# EasyEDA schematic LcsNodes-Ext-Dual-Power-Module-B.02.00.json

## Sheets
1 Extension Connector, Bridge, RailCom Dectector: TITLE: LcsNodes-Ext-Dual-Power-Module\nConnector, Logic; REV: B.02.00; Date: 2023-01-27; Sheet: 2/2; Drawn By: helmut-f; Company: Your Company
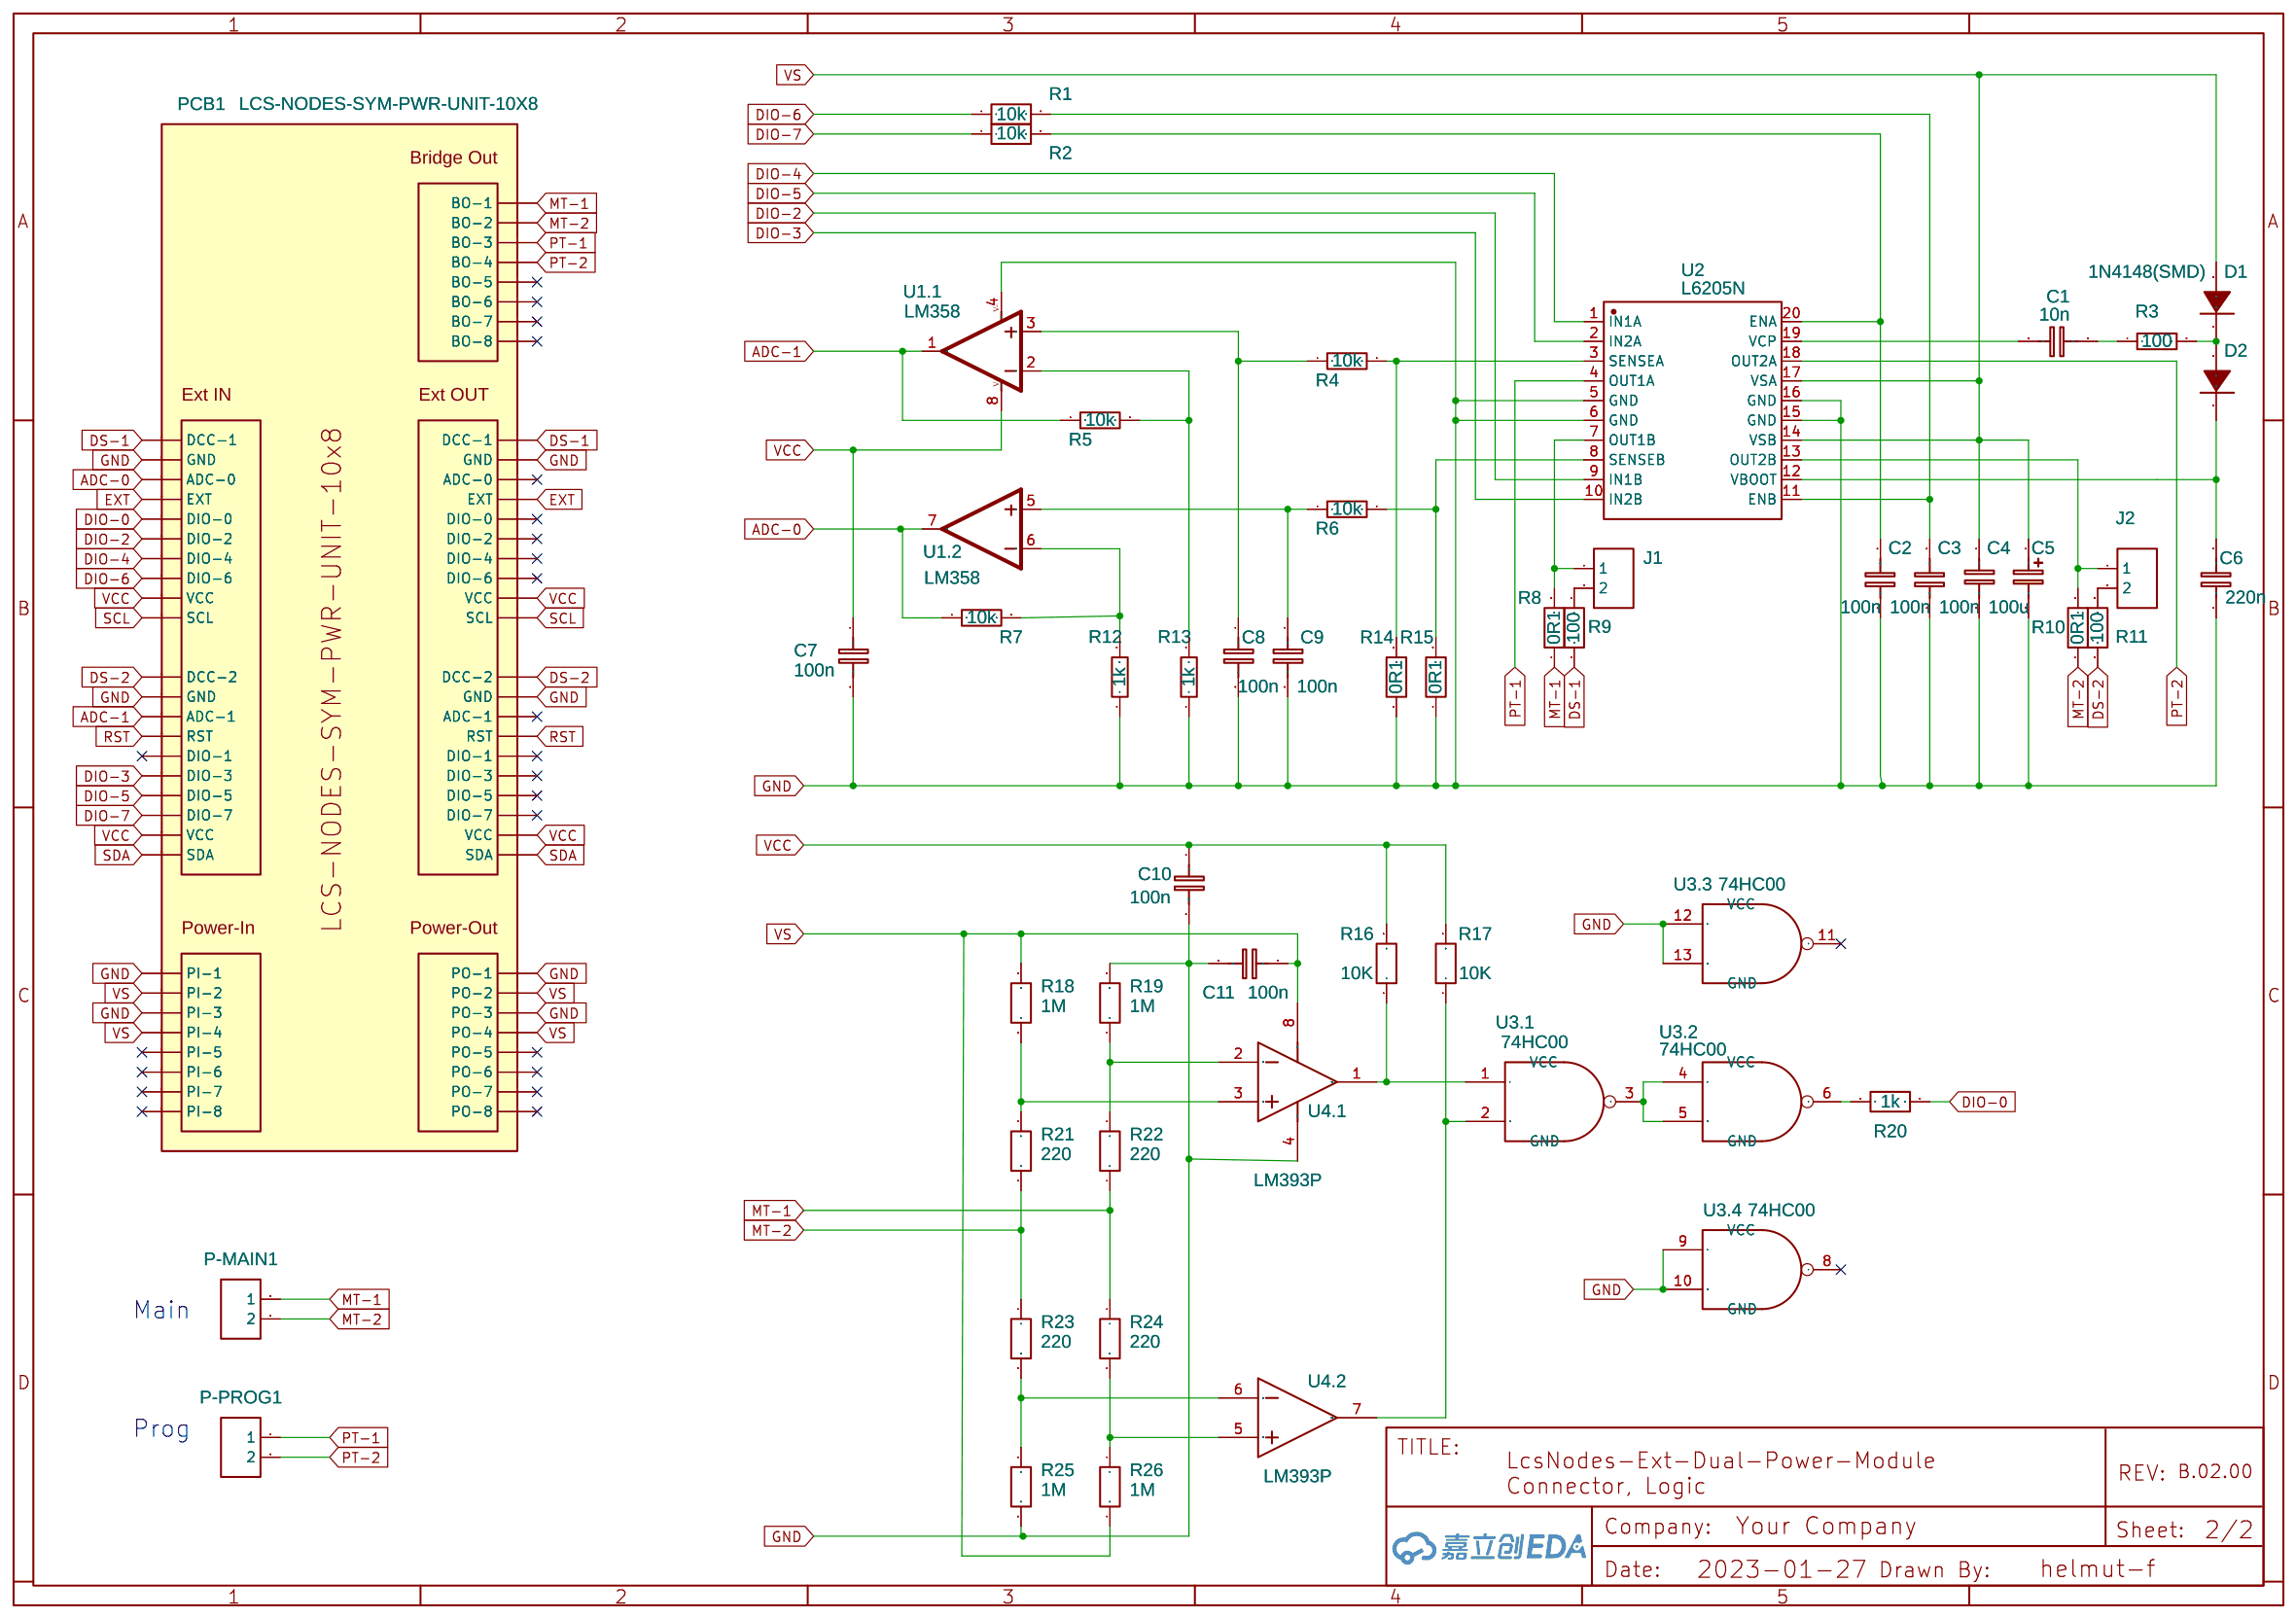
[diagram p0: Extension Connector, Bridge, RailCom Dectector]
2 Block Diagram: TITLE: LcsNodes-Ext-Dual-Power-Module\nBlock Diagram; REV: 1.0; Date: 2023-03-13; Sheet: 1/2
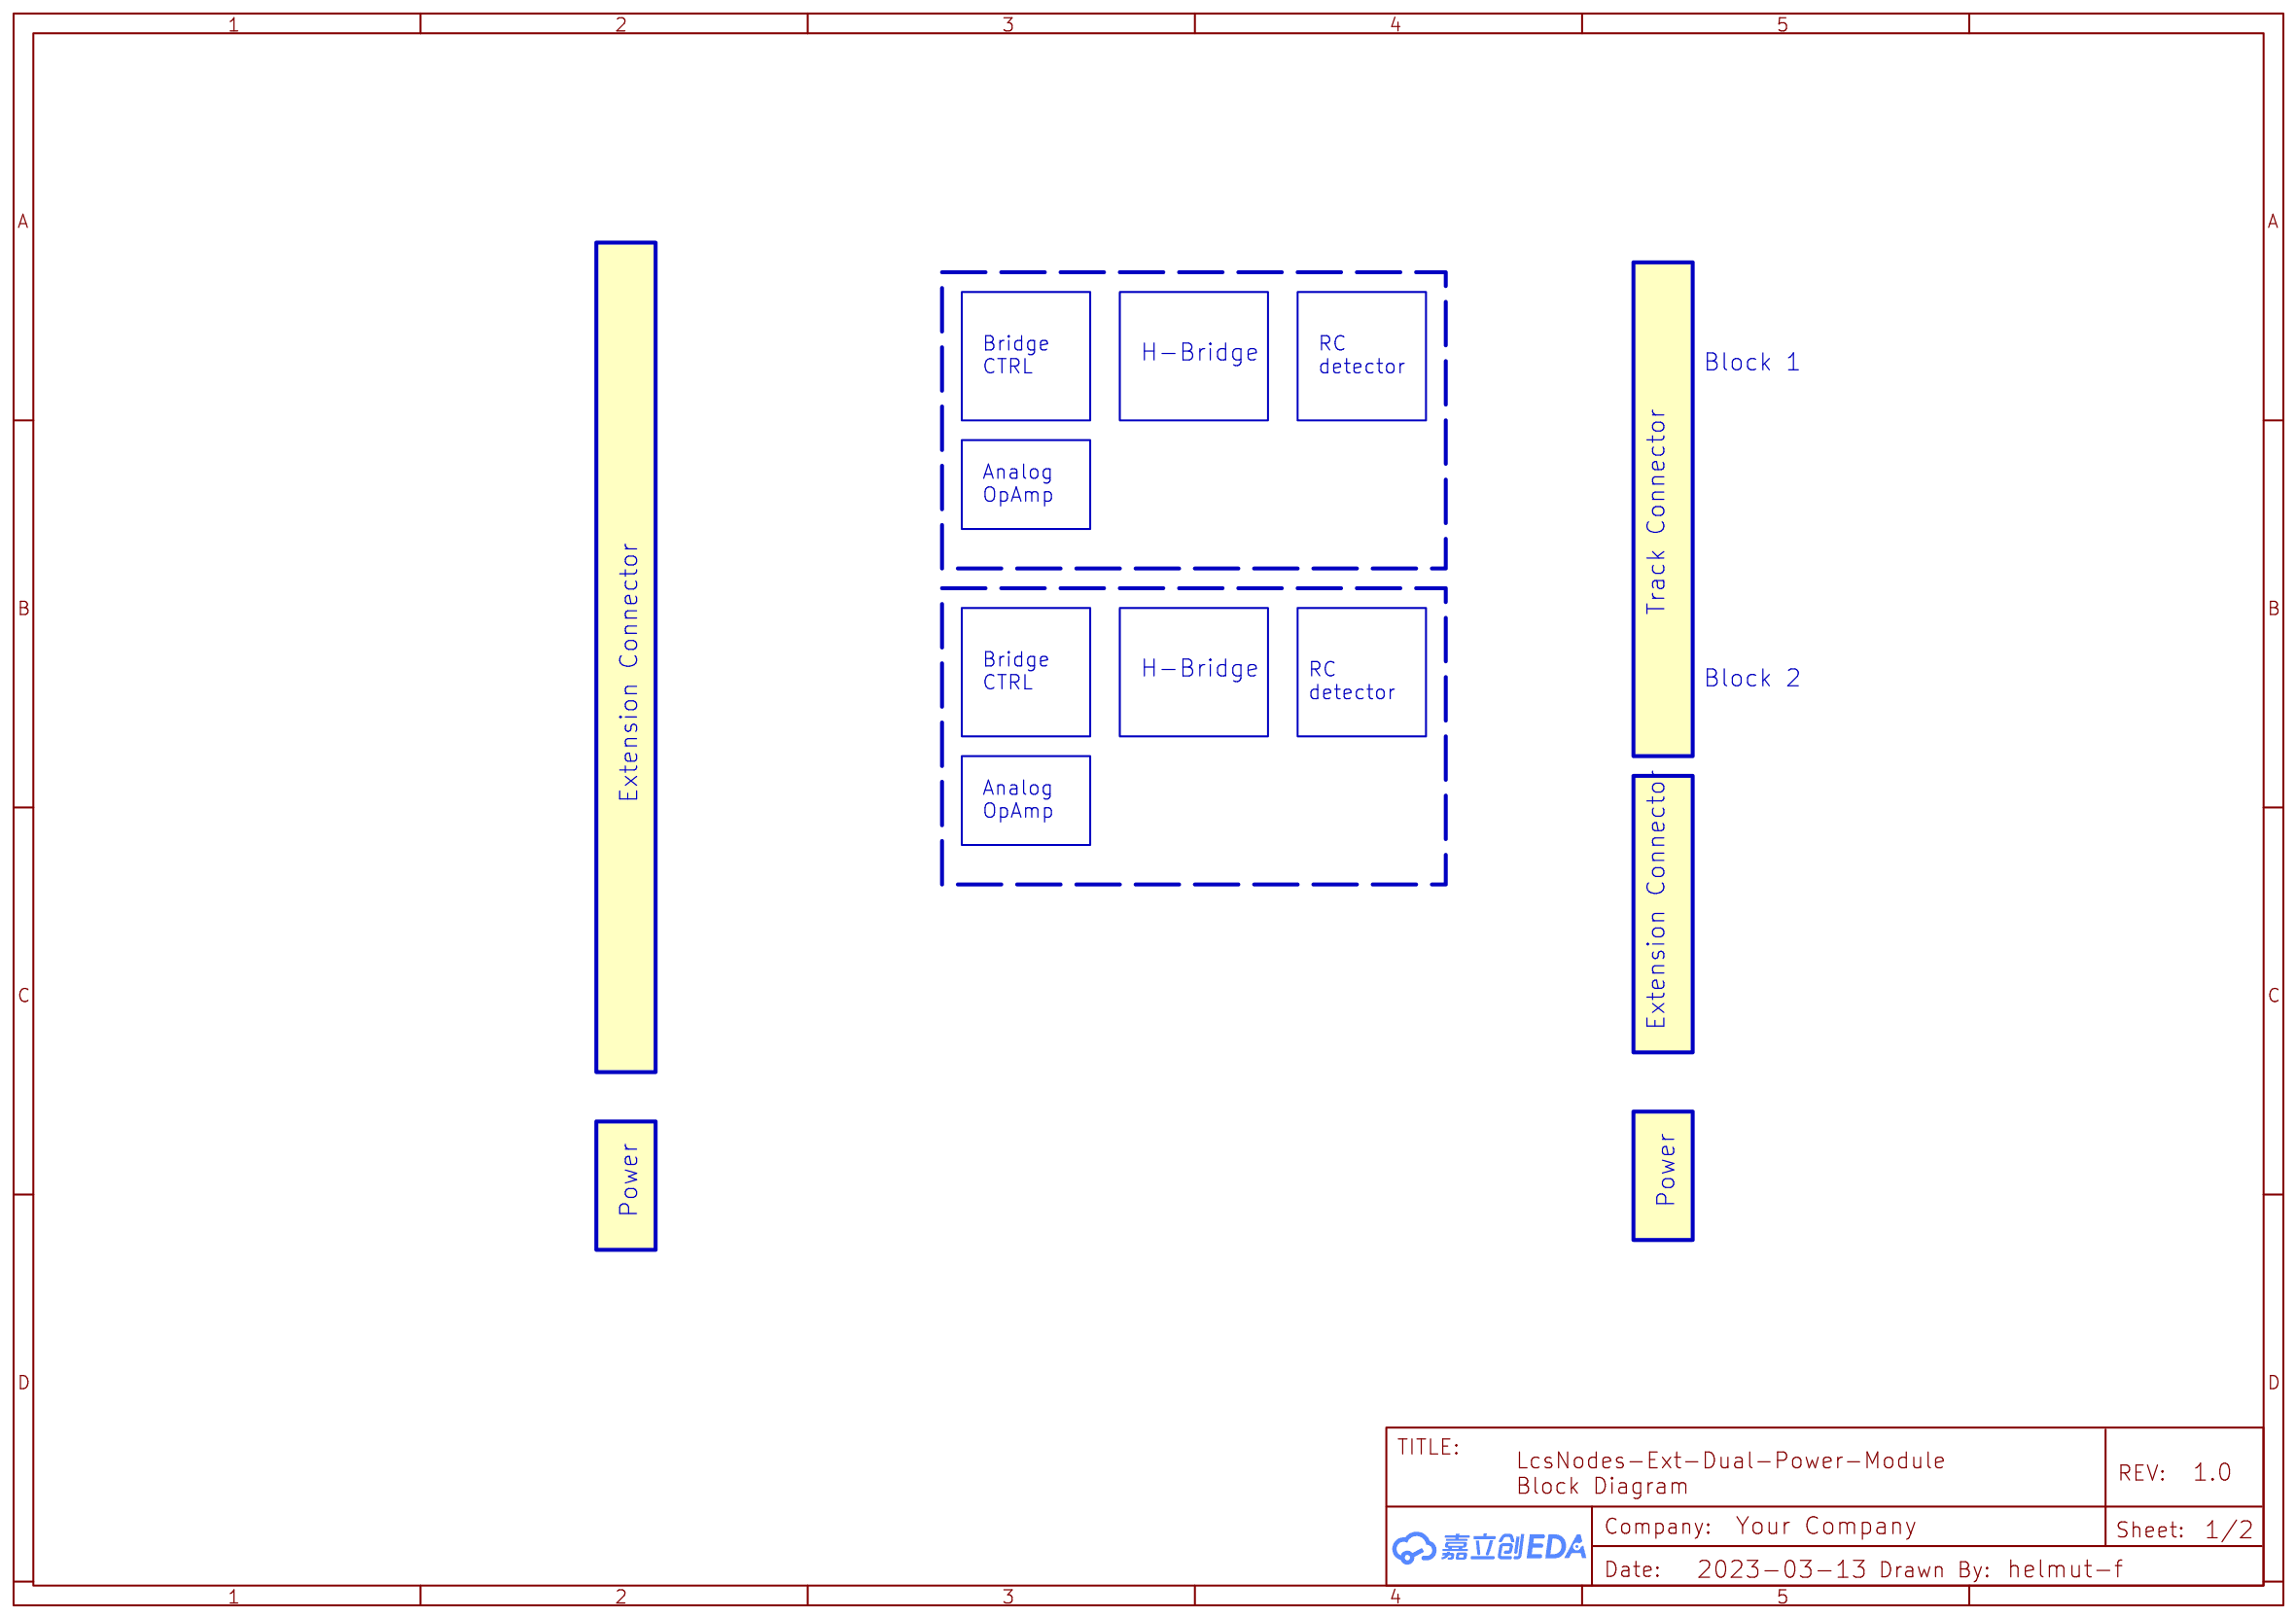
[diagram p1: Block Diagram]

## Parts
C1  10n  [C1206]
C2  100n  [C1206]
C3  100n  [C1206]
C4  100n  [C1206]
C5  100u  [CAP-D6.3×H7.7]
C6  220n  [C1206]
C7  100n  [C1206]
C8  100n  [C1206]
C9  100n  [C1206]
C10  100n  [C1206]
C11  100n  [C1206]
D1  1N4148(SMD)  [LL-34_L3.5-W1.5-RD]
D2  1N4148(SMD)  [LL-34_L3.5-W1.5-RD]
J1  HDR-M-2.54_1x2  [HDR-M-2.54_1X2]
J2  HDR-M-2.54_1x2  [HDR-M-2.54_1X2]
P-MAIN1  CONN-TH_2P-P5.08  [CONN-TH_2P-P5.08]
P-PROG1  CONN-TH_2P-P5.08  [CONN-TH_2P-P5.08]
PCB1  LCS-NODES-SYM-PWR-UNIT-10X8  [LCS-NODES-FP-PWR-UNIT-10X8]
R1  10k  [R1206]
R2  10k  [R1206]
R3  100  [R1206]
R4  10k  [R1206]
R5  10k  [R1206]
R6  10k  [R1206]
R7  10k  [R1206]
R8  0R1  [R_AXIAL-0.6]
R9  100  [R1206]
R10  0R1  [R_AXIAL-0.6]
R11  100  [R1206]
R12  1k  [R1206]
R13  1k  [R1206]
R14  0R1  [R_AXIAL-0.6]
R15  0R1  [R_AXIAL-0.6]
R16  10K  [R1206]
R17  10K  [R1206]
R18  1M  [R1206]
R19  1M  [R1206]
R20  1k  [R1206]
R21  220  [R1206]
R22  220  [R1206]
R23  220  [R1206]
R24  220  [R1206]
R25  1M  [R1206]
R26  1M  [R1206]
U1  LM358  [DIP-8_L10.1-W6.3-P2.54-LS7.6-BL]  (sections 1,2)
U2  L6205N  [PDIP-20_L24.5-W7.3-P2.54-LS7.9-BL]
U3  74HC00  [PDIP-14_L19.2-W6.4-P2.54-LS8.0-BL]  (sections 1,2,3,4)
U4  LM393P  [DIP-8_L10.1-W6.3-P2.54-LS7.6-BL]  (sections 1,2)

## Library data of the parts
C1-C4 C6 = C_0603_EU: Contributor: LCEDA_Lib
C5 = C_Tan_SMD_A_EU: Contributor: LCEDA_Lib
C7-C11 = C_0603_EU: Contributor: LCEDA_Lib; Package Display: No
D1 D2 = 1N4148(SMD): Contributor: lcsc; Supplier: LCSC; Supplier Part: C9900022326; Manufacturer: null; JLCPCB Part Class: Extended Part; link: https://lcsc.com/eda_search?q=C9900022326&%26type=1&ref=editor
J1 J2 = HDR-M-2.54_1x2: Supplier Part: C124375; Supplier: LCSC; Contributor: LCEDA_Lib
P-MAIN1 P-PROG1 = CONN-TH_2P-P5.08: Supplier: LCSC; Contributor: LCEDA_Lib
PCB1 = LCS-NODES-SYM-PWR-UNIT-10X8: Contributor: helmut-f; Package Display: No
R1 R2 R8-R11 R16 R17 R19-R26 = R_AXIAL-0.3_EU: Contributor: LCEDA_Lib
R3-R7 R12 R13 = RESISTOR-AXIAL-0.1
R14 R15 = R_AXIAL-0.5_EU: Contributor: LCEDA_Lib
R18 = R_AXIAL-0.3_EU: Contributor: LCEDA_Lib; Package Display: No
U1 = LM358: Contributor: SparkFun; subpart_no: 1
U2 = L6205N: Supplier: LCSC; Supplier Part: C962260; Manufacturer: STMicroelectronics; Contributor: LCSC
U3 = 74HC00: Contributor: David EL; subpart_no: 1
U4 = LM393P: Supplier: LCSC; Manufacturer: TI; image: //image.lceda.cn/szlcsc/C5209.jpg; Supplier Part: C5209; subpart_no: 1

## Nets
GND: C2.1 C3.1 C4.2 C5.2 C6.1 C7.2 C8.2 C9.2 C10.2 C11.2 PCB1.11(GND) PCB1.21(GND) PCB1.34(PI-1) PCB1.35(PI-3) PCB1.51(GND) PCB1.61(GND) PCB1.70(PO-1) PCB1.71(PO-3) R12.1 R13.1 R14.1 R15.1 R19.2 R25.2 U1.4(V-) U2.5(GND) U2.6(GND) U2.15(GND) U2.16(GND) U3.9(A) U3.10(B) U3.12(A) U3.13(B) U4.4(GND)
VCC: C7.1 C10.1 PCB1.18(VCC) PCB1.28(VCC) PCB1.58(VCC) PCB1.68(VCC) R16.2 R17.2 U1.8(V+)
ADC-0: PCB1.22(ADC-0) R7.1 U1.7(OUT)
ADC-1: PCB1.12(ADC-1) R5.1 U1.1(OUT)
DIO-0: PCB1.24(DIO-0) R20.1
DIO-2: PCB1.25(DIO-2) U2.9(IN1B)
DIO-3: PCB1.15(DIO-3) U2.10(IN2B)
DIO-4: PCB1.26(DIO-4) U2.1(IN1A)
DIO-5: PCB1.16(DIO-5) U2.2(IN2A)
DIO-6: PCB1.27(DIO-6) R1.1
DIO-7: PCB1.17(DIO-7) R2.1
DS-1: PCB1.20(DCC-1) PCB1.50(DCC-1) R9.2
DS-2: PCB1.10(DCC-2) PCB1.60(DCC-2) R11.1
EXT: PCB1.23(EXT) PCB1.53(EXT)
MT-1: P-MAIN1.1 PCB1.40(BO-1) R8.1 R22.1 R24.1
MT-2: P-MAIN1.2 PCB1.44(BO-2) R10.1 R21.1 R23.1
PT-1: P-PROG1.1 PCB1.41(BO-3) U2.4(OUT1A)
PT-2: P-PROG1.2 PCB1.45(BO-4) U2.18(OUT2A)
RST: PCB1.13(RST) PCB1.63(RST)
SCL: PCB1.29(SCL) PCB1.59(SCL)
SDA: PCB1.19(SDA) PCB1.69(SDA)
VS: C4.1 C5.1 C11.1 D1.2(A) PCB1.30(PI-2) PCB1.31(PI-4) PCB1.74(PO-2) PCB1.75(PO-4) R18.2 R26.2 U2.14(VSB) U2.17(VSA) U4.8(VCC)
Net-(C1-1): C1.1 U2.19(VCP)
Net-(C1-2): C1.2 R3.1
Net-(C2-2): C2.2 R2.2 U2.20(ENA)
Net-(C3-2): C3.2 R1.2 U2.11(ENB)
Net-(C6-2): C6.2 D2.1(C) U2.12(VBOOT)
Net-(C8-1): C8.1 R4.1 U1.3(+IN)
Net-(C9-1): C9.1 R6.1 U1.5(+IN)
Net-(D1-1): D1.1(C) D2.2(A) R3.2
Net-(J1-1): J1.1 R8.2 U2.7(OUT1B)
Net-(J1-2): J1.2 R9.1
Net-(J2-1): J2.1 R10.2 U2.13(OUT2B)
Net-(J2-2): J2.2 R11.2
Net-(R4-2): R4.2 R14.2 U2.3(SENSEA)
Net-(R5-2): R5.2 R13.2 U1.2(-IN)
Net-(R6-2): R6.2 R15.2 U2.8(SENSEB)
Net-(R7-2): R7.2 R12.2 U1.6(-IN)
Net-(R16-1): R16.1 U3.1(A) U4.1(1OUT)
Net-(R17-1): R17.1 U3.2(B) U4.7(2OUT)
Net-(R18-1): R18.1 R21.2 U4.3(1IN+)
Net-(R19-1): R19.1 R22.2 U4.2(1IN-)
Net-(R20-2): R20.2 U3.6(Y)
Net-(R23-2): R23.2 R25.1 U4.6(2IN-)
Net-(R24-2): R24.2 R26.1 U4.5(2IN+)
Net-(U3.1-3): U3.3(Y) U3.4(A) U3.5(B)

Not connected (* = marked no-connect by the designer): PCB1 14(DIO-1)* 32(PI-6)* 33(PI-8)* 36(PI-5)* 37(PI-7)* 42(BO-5)* 43(BO-7)* 46(BO-6)* 47(BO-8)* 52(ADC-0)* 54(DIO-0)* 55(DIO-2)* 56(DIO-4)* 57(DIO-6)* 62(ADC-1)* 64(DIO-1)* 65(DIO-3)* 66(DIO-5)* 67(DIO-7)* 72(PO-5)* 73(PO-7)* 76(PO-6)* 77(PO-8)*; U3 7(GND) 8(Y)* 11(Y)* 14(VCC)

## Notes on the sheets
sheet 1
- Main
- Prog
sheet 2
- Bridge
  CTRL
- H-Bridge
- RC
  detector
- Block 1
- Analog
  OpAmp
- Track Connector
- Bridge
  CTRL
- H-Bridge
- RC
  detector
- Block 2
- Analog
  OpAmp
- Extension Connector
- Extension Connector
- Power
- Power
